# EAGLE design TurntableStrobe (EAGLE 7.1.0)
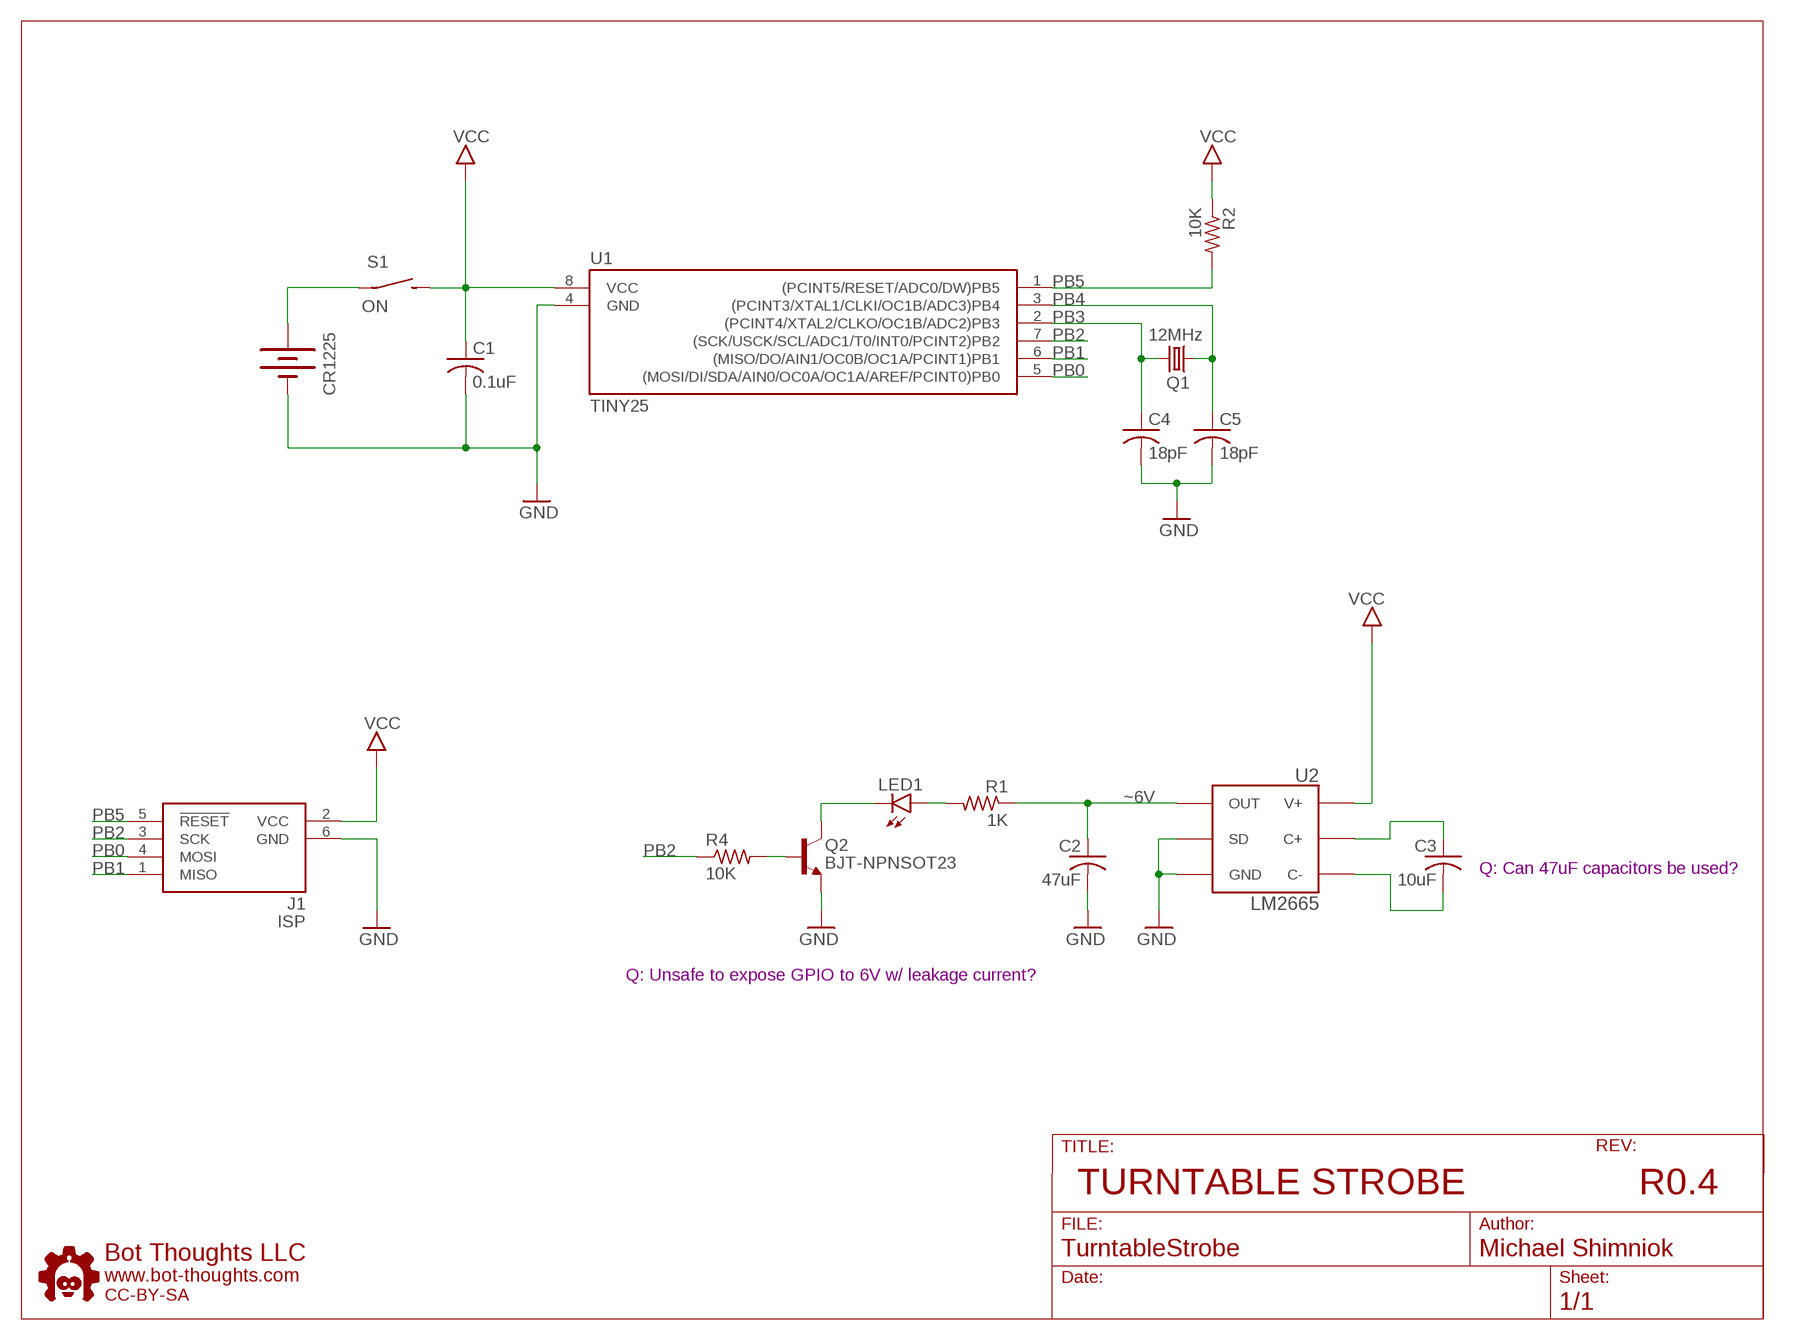
[diagram p0: schematic, sheet 1]

## Parts
C1  0.1uF  C-USC0603  [C0603]
C2  47uF  C-USC0603  [C0603]
C3  10uF  C-USC0603  [C0603]
C4  18pF  C-USC0603  [C0603]
C5  18pF  C-USC0603  [C0603]
CR1225  BATTERY12PTH  [BATTCON_12MM_PTH]
J1  ISP  AVRISP6_TP  [2X3_TP]
LED1  LED5MMRA  [LED5MMRA]
Q1  12MHz  CRYSTALNDK5X3  [NDK_2PAD_5X3]
Q2  BJT-NPNSOT23  [SOT-23]
R1  1K  R-US_R0603  [R0603]
R2  10K  R-US_R0603  [R0603]
R4  10K  R-US_R0603  [R0603]
S1  ON  SPST_TAC_RECT1  [6MMTACTILE_RECT]
U1  TINY25  TINY25-20SSU  [SOIC8N]
U2  LM2665  [SOT23-6]
U$5  BTLOGO-LOGO-SM  [BTLOGOS]

## Nets
GND: C1.2 C2.2 C4.2 C5.2 CR1225.GND(-) J1.6(GND) Q2.2(E) U1.4(GND) U2.2(GND) U2.4(SD)
N$1: Q2.3(B) R4.2
N$2: C3.1 U2.6(C+)
N$3: LED1.A R1.2
N$5: C3.2 U2.3(C-)
N$6: LED1.C Q2.1(C)
PB0: J1.4(MOSI) U1.5((MOSI/DI/SDA/AIN0/OC0A/OC1A/AREF/PCINT0)PB0)
PB1: J1.1(MISO) U1.6((MISO/DO/AIN1/OC0B/OC1A/PCINT1)PB1)
PB2: J1.3(SCK) R4.1 U1.7((SCK/USCK/SCL/ADC1/T0/INT0/PCINT2)PB2)
PB3: C4.1 Q1.P$2 U1.2((PCINT4/XTAL2/CLKO/OC1B/ADC2)PB3)
PB4: C5.1 Q1.P$1 U1.3((PCINT3/XTAL1/CLKI/OC1B/ADC3)PB4)
PB5: J1.5(!RESET) R2.2 U1.1((PCINT5/RESET/ADC0/DW)PB5)
VBAT: CR1225.VCC@1(+) S1.P$1(P)
VCC: C1.1 J1.2(VCC) R2.1 S1.P$2(S) U1.8(VCC) U2.1(V+)
VHI: C2.1 R1.1 U2.5(OUT)

## Notes on the sheet
- ~6V
- Q: Can 47uF capacitors be used?
- Q: Unsafe to expose GPIO to 6V w/ leakage current?
- TURNTABLE STROBE | R0.4

## Library data of the parts
C1-C5 = rcl:C-US: CAPACITOR, American symbol
CR1225 = SparkFun:BATTERY: Battery Holders Various common sizes : AA, AAA, 20mm coin cell and 12mm coin cell.
J1 = bt_avr:AVRISP6: 6-pin dual-row connector for Atmel AVRISP programmer interface
LED1 = bt_opto:LED: LED Various packages
Q1 = bt_crystal:CRYSTAL: CRYSTAL
Q2 = bt_transistor:BJT-NPN: NPN Transistor Small signal NPN Bipolar Junction Transistor (BJT). Use this device to represent any of a number of such transistors with similar package and pinout: 2N4401, 2N3904, 2N2222, etc.
R1 R2 R4 = rcl:R-US_: RESISTOR, American symbol
S1 = bt_electromech:SPST: SPST SWITCH
U1 = bt_avr:TINY25: Atmel AVR ATiny25,45,85 8-bit Microcontroller.
U2 = bt_regulator:LM2665: LM2665 - Switched Capacitor Voltage Converter The LM2665 CMOS charge-pump voltage converter operates as a voltage doubler for an input voltage in the range of 2.5 V to 5.5 V. Two low-cost capacitors and a diode (needed during start-up) are used in this circuit to provide up to 40 mA of output current. The LM2665 can also work as a voltage divider to split a voltage in the range of 1.8 V to 11 V in half. The LM2665 operates at 160-kHz oscillator frequency to reduce output resistance and voltage ripple. With an operating current of only 650 μA (operating efficiency greater than 90% with most loads) and 1-μA typical shutdown current, the LM2665 provides ideal performance for battery powered systems.
U$5 = bt:BTLOGO: Bot Thoughts Logo

## Board
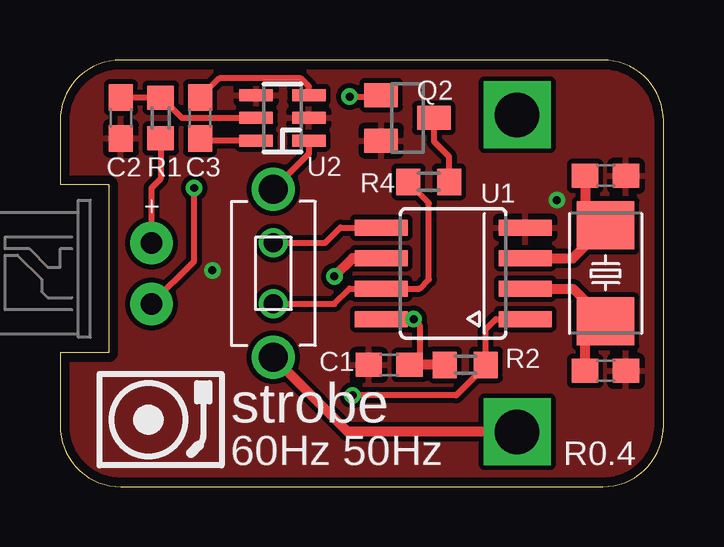
[diagram p1: board, top side]
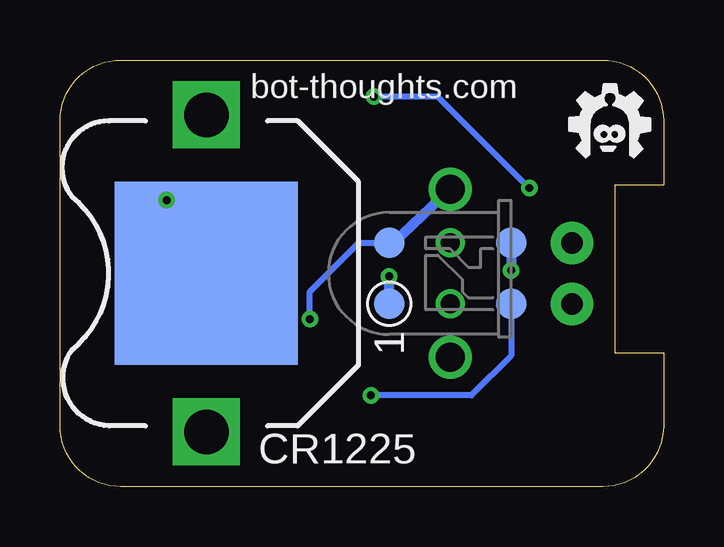
[diagram p2: board, bottom side, seen from below]

Size 25.15 x 17.78 mm. Coordinates in mm from the lower left corner, seen from the top.
Outline: 25.15,2.54 25.15,15.24 arc90 22.61,17.78 2.54,17.78 arc90 0,15.24 0,12.57 2.03,12.57 2.03,5.59 0,5.59 0,2.54 arc90 2.54,0 22.61,0 arc90 25.15,2.54
Copper layers (1*16): Top 0.0356mm / dielectric 1.5011mm / Bottom 0.0356mm
Design rules "default *": minimum track width 6mil, minimum drill 13mil, track to track 6mil, track to pad 6mil, pad to pad 6mil, via to via 6mil, smd to smd 6mil, copper to edge 15mil, drill to drill 6mil, minimum pad ring 7mil, minimum via ring 7mil, stop-mask expansion 4mil, vias tented up to drill 20mil, thermal gap 10mil

### Footprints (pad centres in the part's own frame; a part is rotated, then mirrored left to right if it is on the bottom)
C0603 = smd 1.1 x 1: 1 -0.85,0; 2 0.85,0
BATTCON_12MM_PTH = smd 7.62 x 7.62: GND 0,0 | drill 1.854 square: VCC@1 -6.604,0; VCC@2 6.604,0
2X3_TP = smd 1.27 x 1.27: 1 -1.27,2.54; 2 1.27,2.54; 5 -1.27,-2.54; 6 1.27,-2.54 | drill 0.8: 3 -1.27,0; 4 1.27,0
LED5MMRA = drill 0.9 pad 1.778: A 0,1.27; C 0,-1.27
NDK_2PAD_5X3 = smd 2 x 2.4: P$1 -2,0; P$2 2,0
SOT-23 = smd 1 x 1.4: 1 -0.95,-1.1; 2 0.95,-1.1; 3 0,1.1
R0603 = smd 1 x 1.1: 1 -0.85,0; 2 0.85,0
6MMTACTILE_RECT = drill 1.2: P$1 -3.5,0; P$2 3.5,0
SOIC8N = smd 0.66 x 2.2: 1 -1.905,-3; 2 -0.635,-3; 3 0.635,-3; 4 1.905,-3; 5 1.905,3; 6 0.635,3; 7 -0.635,3; 8 -1.905,3
SOT23-6 = smd 0.5 x 1.4: 1 -0.95,-1.1; 2 0,-1.1; 3 0.95,-1.1; 4 0.95,1.1; 5 0,1.1; 6 -0.95,1.1

### Placement (x,y rotation side)
C1  13.72,5.08 180 top
C2  2.54,15.37 270 top
C3  5.84,15.37 90 top
C4  22.73,4.83 0 top
C5  22.73,12.95 0 top
CR1225  19.05,8.89 90 bottom
J1  8.89,8.89 90 bottom
LED1  3.81,8.89 0 top
Q1  22.73,8.89 270 top
Q2  14.48,15.37 270 top
R1  4.19,15.37 270 top
R2  16.89,5.08 0 top
R4  15.37,12.7 0 top
S1  8.89,8.89 90 top
U1  16.38,8.89 90 top
U2  9.27,15.37 90 top
U$5  2.29,13.59 0 bottom

### Tracks (layer width: path | path; a pad name or v marks a point on that pad's centre or on a via)
GND  (via drill 0.33)
  Bottom 0.406: CR1225.GND 18.92,8.89 v20.7,11.94 | J1.6 v6.35,9.02
  pour Top (isolate 0.203): 2.54,0 22.61,0 arc90 25.15,2.54 25.15,15.24 arc90 22.61,17.78 2.54,17.78 arc90 0,15.24 0,2.54 arc90
N$1
  Top 0.254: Q2.3 15.58,14.39 16.22,13.76 R4.2
N$2
  Top 0.254: U2.6 5.94,14.42 C3.1
N$3
  Top 0.254: R1.2 4.19,12.83 3.81,12.45 LED1.A
N$5
  Top 0.254: U2.3 10.37,16.68 10.03,17.02 6.64,17.02 C3.2
N$6  (via drill 0.33)
  Top 0.254: LED1.C 5.59,9.4 v5.59,12.45 | v12.06,16.26 13.44,16.26 Q2.1
  Bottom 0.254: v5.59,12.45 9.4,16.26 v12.06,16.26
PB0
  Top 0.254: J1.4 11.05,10.16 11.68,10.79 U1.5
PB1  (via drill 0.33)
  Top 0.406: v11.43,8.76 12.19,9.53 U1.6
  Bottom 0.406: J1.1 v11.43,8.76
PB2
  Top 0.254: R4.1 14.61,12.57 15.37,11.81 15.37,8.64 14.99,8.26 U1.7 12.06,8.26 11.43,7.62 J1.3
PB3
  Top 0.406: U1.2 21.38,8.24 Q1.P$2 21.88,6.04 C4.1
PB4
  Top 0.406: U1.3 21.36,9.52 Q1.P$1 21.88,11.74 C5.1
PB5  (via drill 0.33)
  Top 0.254: v12.19,3.81 16.51,3.81 17.65,4.95 R2.2 17.74,6.57 18.16,6.99 U1.1
  Bottom 0.254: J1.5 6.35,5.46 8,3.81 v12.19,3.81
VBAT
  Top 0.406: CR1225.VCC@1 11.99,2.29 S1.P$1
VCC  (via drill 0.33)
  Top 0.254: U2.1 10.37,13.87 S1.P$2 | U1.8 v14.73,6.99 14.99,6.73 14.99,5.5 C1.1
  Top 0.406: R2.1 C1.1
  Bottom 0.254: v14.73,6.99 14.73,8.13 12.7,10.16 J1.2
  Bottom 0.406: J1.2 11.25,10.16 S1.P$2
VHI
  Top 0.254: C2.1 R1.1 4.23,16.22 5.08,15.37 U2.5

### Text on the board
tNames: strobe | 60Hz 50Hz | R0.4
bNames: bot-thoughts.com
tsilk: R1 | C3 | C2 | R0.2 | R3 | IC1 | + | C1 | R2 | Strobe | 50.0Hz
bsilk: bot-thoughts.com | ISP | 1 | CR1225